# Altium schematic sheet power.SchDoc: Power Schematic
size A; DrawnBy: Pramod Sandaruwan; DocumentNumber: 1; Revision: V3; SheetNumber: 1; SheetTotal: 5
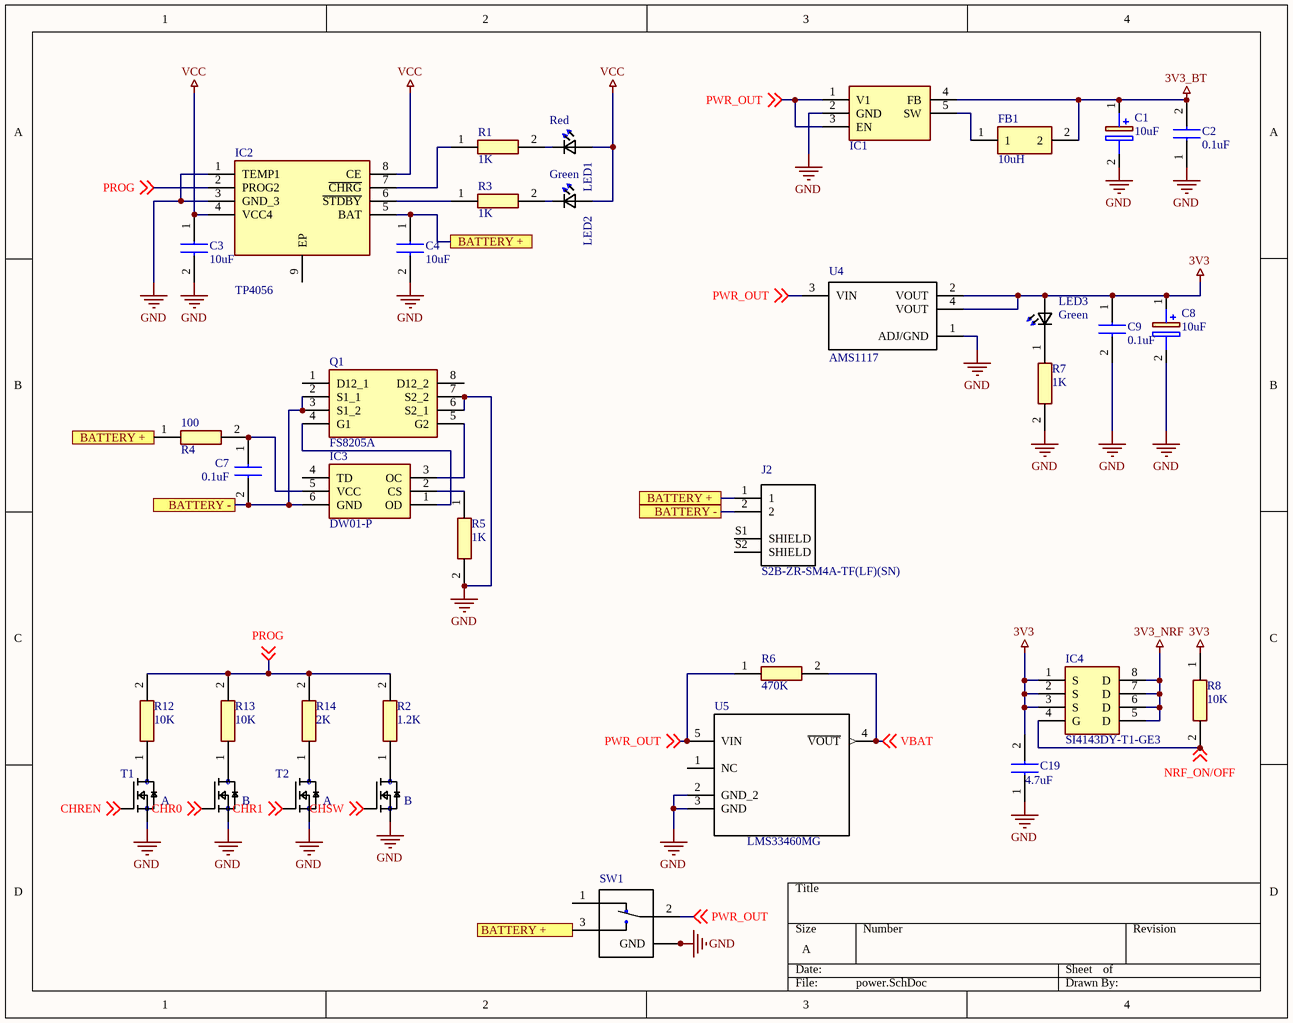
[diagram p0: power.SchDoc]

## Parts
C1  value 10uF  [CAPPM3216X180N]  (hidden comment: tantalum capacitor 1206)
C2  value 0.1uF  [*CAPC1608X95N]  (hidden comment: capacitor 0603)
C3  value 10uF  [CAPC2012X94N]  (hidden comment: 08055A101JAT2A)
C4  value 10uF  [CAPC2012X94N]  (hidden comment: 08055A101JAT2A)
C7  value 0.1uF  [CAPC2012X94N]  (hidden comment: 08055A101JAT2A)
C8  value 10uF  [CAPPM3216X180N]  (hidden comment: tantalum capacitor 1206)
C9  value 0.1uF  [*CAPC1608X95N]  (hidden comment: capacitor 0603)
C19  value 4.7uF  [CAPC2012X94N]  (hidden comment: 08055A101JAT2A)
FB1  value 10uH  [BEADC1608X95N]  (hidden comment: inductor 0603)
IC1  TPS62203  [SOT95P280X145-5N]  (value not drawn)
IC2  TP4056  [SOIC127P600X175-9N]
IC3  DW01-P  [SOT95P280X135-6N]
IC4  SI4143DY-T1-GE3  [SI4143DY-T1-GE3]
J2  S2B-ZR-SM4A-TF(LF)(SN)  [*JST_S2B-ZR-SM4A-TF(LF)(SN)_S2B-ZR-SM4A-TF(LF)(SN)(Primary)]
LED1  value Red  [*0603]  (hidden comment: HSMR-C191)
LED2  value Green  [*0603]  (hidden comment: HSMR-C191)
LED3  value Green  [*0603]  (hidden comment: HSMR-C191)
Q1  FS8205A  [SOP65P640X120-8N]
R1  value 1K  [RESC1608X55N]  (hidden comment: resistor)
R2  value 1.2K  [RESC1608X55N]  (hidden comment: resistor)
R3  value 1K  [RESC1608X55N]  (hidden comment: resistor)
R4  value 100  [RESC2012X65N]  (hidden comment: CPF0805)
R5  value 1K  [RESC2012X65N]  (hidden comment: CPF0805)
R6  value 470K  [RESC1608X55N]  (hidden comment: resistor)
R7  value 1K  [RESC1608X55N]  (hidden comment: resistor)
R8  value 10K  [RESC2012X65N]  (hidden comment: CPF0805)
R12  value 10K  [RESC1608X55N]  (hidden comment: resistor)
R13  value 10K  [RESC1608X55N]  (hidden comment: resistor)
R14  value 2K  [RESC1608X55N]  (hidden comment: resistor)
SW1  1437575-1  [*SW_MLL1200S_MLL1200S(Primary)]  (value not drawn)
T1  PMGD780SN  [*SOP65P210X110-6N]  (value not drawn)
T2  PMGD780SN  [*SOP65P210X110-6N]  (value not drawn)
U4  AMS1117  [*SOT229P700X180-4N]
U5  LMS33460MG  [*SOT65P210X110-5N]

## Ports
BATTERY +, BATTERY -

## Nets
3V3: C8.1(+) C9.1 C19.2 IC4.1(S) IC4.2(S) IC4.3(S) LED3.2(A2) R8.1 U4.2(VOUT) U4.4(VOUT)
3V3_BT: C1.1(+) C2.2 FB1.2 IC1.4(FB)
3V3_NRF: IC4.5(D) IC4.6(D) IC4.7(D) IC4.8(D)
GND: C1.2(-) C2.1 C3.2 C4.2 C8.2(-) C9.2 C19.1 IC1.2(GND) IC2.1(TEMP1) IC2.3(GND_3) Q1.6(S2_1) Q1.7(S2_2) R5.2 R7.2 SW1.G1(GND) SW1.G2(GND) SW1.G3(GND) SW1.G4(GND) T1.1(S) T1.4(S) T2.1(S) T2.4(S) U4.1(ADJ/GND) U5.2(GND_2) U5.3(GND)
VCC: C3.1 IC2.4(VCC4) IC2.8(CE) LED1.2(A2) LED2.2(A2)
BATTERY +: C4.1 IC2.5(BAT) J2.1 R4.1 SW1.3 ; port BATTERY +
BATTERY -: C7.2 IC3.6(GND) J2.2 Q1.2(S1_1) Q1.3(S1_2) ; port BATTERY -
CHR0: T1.5(G) ; off-sheet CHR0
CHR1: T2.2(G) ; off-sheet CHR1
CHREN: T1.2(G) ; off-sheet CHREN
CHSW: T2.5(G) ; off-sheet CHSW
NRF_ON/OFF: IC4.4(G) R8.2 ; off-sheet NRF_ON/OFF
PROG: IC2.2(PROG2) R2.2 R12.2 R13.2 R14.2 ; off-sheet PROG
PWR_OUT: IC1.1(V1) IC1.3(EN) R6.1 SW1.2 U4.3(VIN) U5.5(VIN) ; off-sheet PWR_OUT
VBAT: R6.2 U5.4(~{VOUT}) ; off-sheet VBAT
NetC7_1: C7.1 IC3.5(VCC) R4.2
NetFB1_1: FB1.1 IC1.5(SW)
NetIC2_6: IC2.6(~{STDBY}) R3.1
NetIC2_7: IC2.7(~{CHRG}) R1.1
NetIC3_1: IC3.1(OD) Q1.4(G1)
NetIC3_2: IC3.2(CS) R5.1
NetIC3_3: IC3.3(OC) Q1.5(G2)
NetLED1_1: LED1.1(K2) R1.2
NetLED2_1: LED2.1(K2) R3.2
NetLED3_1: LED3.1(K2) R7.1
NetR2_1: R2.1 T2.3(D)
NetR12_1: R12.1 T1.6(D)
NetR13_1: R13.1 T1.3(D)
NetR14_1: R14.1 T2.6(D)

Not connected (* = marked no-connect by the designer): IC2 9(EP); IC3 4(TD); J2 S1(SHIELD) S2(SHIELD); Q1 1(D12_1) 8(D12_2); SW1 1; U5 1(NC)

## Notes on the sheet
- (in symbol PMGD780SN) A; B

## Library data of the parts
C1 C8 = tantalum capacitor 1206: Capacitor Polarised
C2 C9 = capacitor 0603: Capacitor
C3 C4 C7 C19 = 08055A101JAT2A: Capacitor; Manufacturer_Name: AVX; Allied_Number: 70474488; Datasheet Link: https://componentsearchengine.com/Datasheets/1/06031A100FAT2A.pdf; Height: 0.94mm; Manufacturer_Part_Number: 08055A101JAT2A; Mouser Part Number: 581-08055A101J; Mouser Price/Stock: https://www.mouser.com/Search/Refine.aspx?Keyword=581-08055A101J; RS Part Number: 0391000P; RS Price/Stock: http://uk.rs-online.com/web/p/products/0391000P; Allied Price/Stock: https://www.alliedelec.com/avx-08055a101jat2a/70474488/
FB1 = inductor 0603: Ferrite Bead
IC1 = TPS62203: Integrated Circuit
IC2 = TP4056: Integrated Circuit; Manufacturer_Name: NanJing Top Power; Datasheet Link: https://dlnmh9ip6v2uc.cloudfront.net/datasheets/Prototyping/TP4056.pdf; Height: 1.75mm; Manufacturer_Part_Number: TP4056
IC3 = DW01-P: Integrated Circuit; Manufacturer_Name: Fortune Semiconductor Corporation; Datasheet Link: https://cdn.sparkfun.com/assets/learn_tutorials/2/5/1/DW01-P_DataSheet_V10.pdf; Height: 1.35mm; Manufacturer_Part_Number: DW01-P; ComponentLink1Description: DW01; ComponentLink1URL: https://lcsc.com/product-detail/MOSFET_DW01_C181096.html
IC4 = SI4143DY-T1-GE3: Integrated Circuit
J2 = S2B-ZR-SM4A-TF(LF)(SN): Connector Header Surface Mount, Right Angle 2 position 0.059 _1.50mm_; MF: JST Sales; MP: S2B-ZR-SM4A-TF_LF__SN_; Package: None; SnapEDA_Link: https://www.snapeda.com/parts/S2B-ZR-SM4A-TF%28LF%29%28SN%29/JST%20Sales%20America%20Inc./view-part/567593/?ref=snap; Availability: Unavailable; Price: None; Value: *
LED1-LED3 = HSMR-C191: LED Indication - Discrete 3.4V 0603 _1608 Metric_; MF: Broadcom Limited; SnapEDA_Link: https://www.snapeda.com/parts/HSMR-C191/Broadcom%20Limited/view-part/2190324/?ref=snap; Availability: Unavailable; MP: HSMR-C191; Price: None; Package: 0603 Broadcom
Q1 = FS8205A: Transistor; Manufacturer_Name: SII Semiconductor; Datasheet Link: http://www.ic-fortune.com/upload/Download/FS8205A-DS-12_EN.pdf; Height: 1.2mm; Manufacturer_Part_Number: FS8205A
R4 R5 R8 = CPF0805: Resistor; Manufacturer_Name: TE Connectivity; Manufacturer_Part_Number: CPF0805B100KE; Allied_Number: 70286772; Datasheet Link: http://docs-europe.electrocomponents.com/webdocs/13d1/0900766b813d116f.pdf; Height: 0.65mm; Mouser Part Number: 279-CPF0805B100KE; Mouser Price/Stock: https://www.mouser.com/Search/Refine.aspx?Keyword=279-CPF0805B100KE; RS Part Number: 6662673; RS Price/Stock: https://uk.rs-online.com/web/p/products/6662673; Allied Price/Stock: https://www.alliedelec.com/te-connectivity-cpf0805b100ke/70286772/
SW1 = MLL1200S: Slide Switch SPDT Surface Mount, Right Angle; MF: TE Connectivity; TE_purchase_URL: https://www.te.com/usa-en/product-1437575-1.html?te_bu=Cor&te_type=disp&te_campaign=seda_glo_cor-seda-global-disp-prtnr-fy19-seda-model-bom-cta_sma-317_1&elqCampaignId=32493; Availability: Unavailable; SnapEDA_Link: https://www.snapeda.com/parts/MLL1200S/TE%20Connectivity%20ALCOSWITCH%20Switches/view-part/1494234/?ref=snap; Price: None; MP: MLL1200S; Package: None; Value: *
T1 T2 = PMGD780SN: Mosfet Array 2 N-Channel _Dual_ 20V 1.2A 390mW Surface Mount 6-TSSOP; MF: NXP Semiconductors; Package: SOT-363 NXP Semiconductors; Price: None; MP: PMGD780SN; Availability: Unavailable; SnapEDA_Link: https://www.snapeda.com/parts/PMGD130UN/NXP%20Semiconductors/view-part/4258135/?ref=snap; Value: *
U4 = AMS1117: 1A LOW DROPOUT VOLTAGE REGULATOR; MF: Seeed Technology; MP: AMS1117; SnapEDA_Link: https://www.snapeda.com/parts/AMS1117/Seeed%20Technology%20Co.%2C%20Ltd/view-part/?ref=snap; Price: None; Package: SOT-223 Seeed Technology; Availability: Unavailable; Value: *
U5 = LMS33460MG: 3V Under Voltage Detector 5-SC70 -40 to 85; MF: Texas Instruments; MP: LMS33460MG/NOPB; Package: SC-70 Texas Instruments; Price: None; Availability: Unavailable; SnapEDA_Link: https://www.snapeda.com/parts/LMS33460MG/NOPB/Texas%20Instruments/view-part/16255/?ref=snap; Value: *